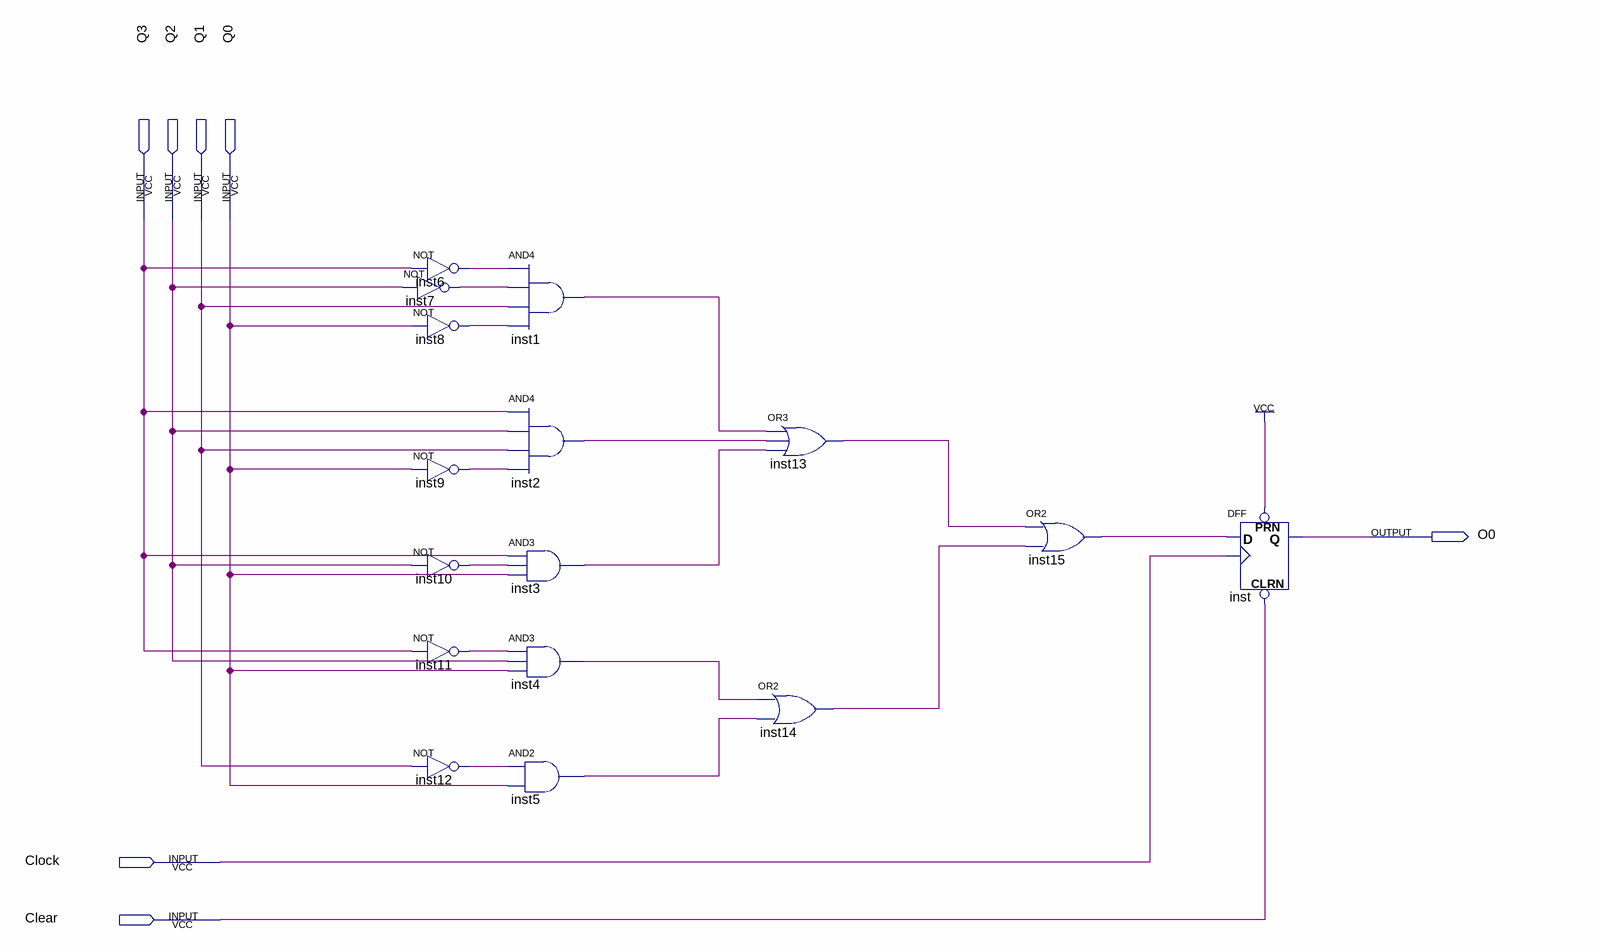
[diagram p0: schematic sheet]
// Quartus schematic D0.bdf as structural Verilog: 16 symbols, 7 pins
module D0 (
  input  Q3,
  input  Q2,
  input  Q1,
  input  Q0,
  input  Clock,
  input  Clear,
  output O0
);

  wire inst1_out, inst2_out, inst3_out, inst4_out, inst5_out, inst6_out, inst7_out, inst8_out, inst9_out,
       inst10_out, inst11_out, inst12_out, inst13_out, inst14_out, inst15_out;

  not inst6 (inst6_out, Q3);
  not inst7 (inst7_out, Q2);
  not inst8 (inst8_out, Q0);
  not inst9 (inst9_out, Q0);
  not inst10 (inst10_out, Q2);
  not inst11 (inst11_out, Q3);
  not inst12 (inst12_out, Q1);
  and inst1 (inst1_out, inst6_out, inst7_out, Q1, inst8_out);
  and inst2 (inst2_out, Q3, Q2, Q1, inst9_out);
  and inst3 (inst3_out, Q3, inst10_out, Q0);
  and inst4 (inst4_out, inst11_out, Q2, Q0);
  and inst5 (inst5_out, inst12_out, Q0);
  or inst13 (inst13_out, inst1_out, inst2_out, inst3_out);
  or inst14 (inst14_out, inst4_out, inst5_out);
  or inst15 (inst15_out, inst13_out, inst14_out);
  DFF inst (.CLRN(Clear), .CLK(Clock), .D(inst15_out), .PRN(1'b1), .Q(O0));
endmodule
